# EAGLE schematic nocLock (EAGLE 7.1.0)
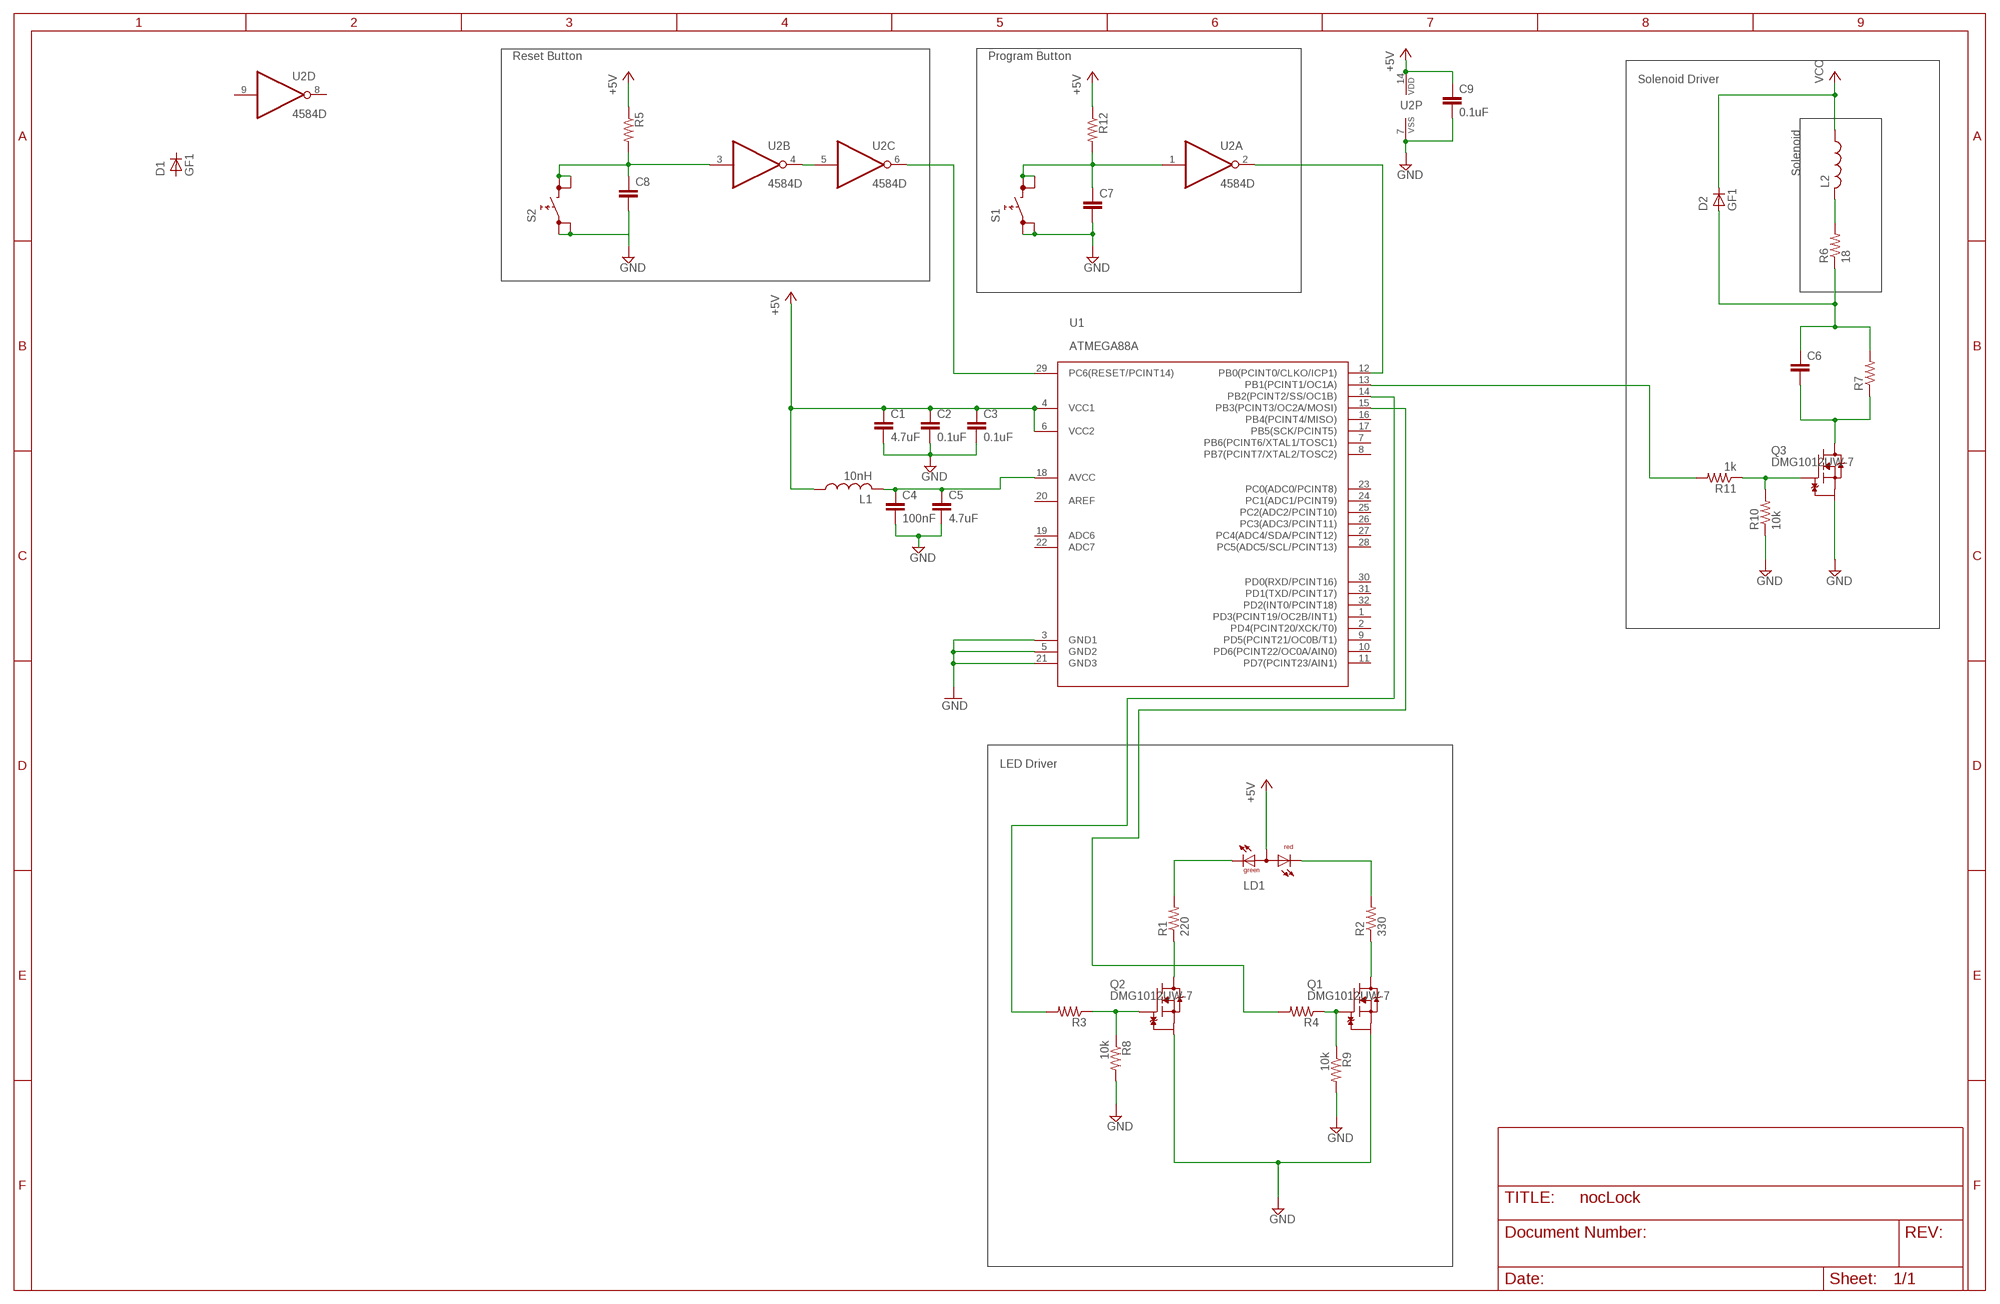
[diagram p0: schematic, sheet 1]

## Parts
C1  4.7uF  C-EUC0805  [C0805]
C2  0.1uF  C-EUC0805  [C0805]
C3  0.1uF  C-EUC0805  [C0805]
C4  100nF  C-EUC0805  [C0805]
C5  4.7uF  C-EUC0805  [C0805]
C6  C-EUC0805  [C0805]
C7  C-EUC0805  [C0805]
C8  C-EUC0805  [C0805]
C9  0.1uF  C-EUC0805  [C0805]
D1  GF1  [SMA-DO214AC]
D2  GF1  [SMA-DO214AC]
L1  10nH  L-USL4532C  [L4532M]
L2  L-USL4532C  [L4532M]
LD1  DUOLED-RG-A  [DUOLED-A-5MM]
Q1  DMG1012UW-7  [SOT323]
Q2  DMG1012UW-7  [SOT323]
Q3  DMG1012UW-7  [SOT323]
R1  220  R-US_R0805  [R0805]
R2  330  R-US_R0805  [R0805]
R3  R-US_R0805  [R0805]
R4  R-US_R0805  [R0805]
R5  R-US_R0805  [R0805]
R6  18  R-US_R0805  [R0805]
R7  R-US_R0805  [R0805]
R8  10k  R-US_R0805  [R0805]
R9  10k  R-US_R0805  [R0805]
R10  10k  R-US_R0805  [R0805]
R11  1k  R-US_R0805  [R0805]
R12  R-US_R0805  [R0805]
S1  SKHMPSE010  [SKHMPXE010]
S2  SKHMPSE010  [SKHMPXE010]
U1  ATMEGA88A  [TQFP32]
U2  4584D  [SO14]

## Nets
+5V: C1.1 C2.1 C3.1 C9.1 L1.1 LD1.A R5.1 R12.1 U1.4(VCC1) U1.6(VCC2) U2.14(P:VDD)
GND: C1.2 C2.2 C3.2 C4.2 C5.2 C7.2 C8.2 C9.2 Q1.3(S) Q2.3(S) Q3.3(S) R8.2 R9.2 R10.1 S1.1(1.1) S1.2(1.2) U1.3(GND1) U1.5(GND2) U1.21(GND3) U2.7(P:VSS)
GND1: S2.1(1.1) S2.2(1.2)
N$1: Q1.2(G) R4.1 R9.1
N$2: LD1.CX(CG) R1.2
N$3: LD1.CR R2.2
N$4: Q1.1(D) R2.1
N$5: Q2.1(D) R1.1
N$6: Q2.2(G) R3.1 R8.1
N$7: C4.1 C5.1 L1.2 U1.18(AVCC)
N$8: L2.2 R6.2
N$9: Q3.2(G) R10.2 R11.1
N$10: C6.1 D2.A R6.1 R7.2
N$11: C6.2 Q3.1(D) R7.1
N$12: U2.4(B:O) U2.5(C:I)
N$13: U1.12(PB0(PCINT0/CLKO/ICP1)) U2.2(A:O)
N$14: R11.2 U1.13(PB1(PCINT1/OC1A))
N$15: C8.1 R5.2 U2.3(B:I)
N$16: S2.3(2.1) S2.4(2.2)
N$17: R3.2 U1.14(PB2(PCINT2/SS/OC1B))
N$18: R4.2 U1.15(PB3(PCINT3/OC2A/MOSI))
N$19: C7.1 R12.2 S1.3(2.1) S1.4(2.2) U2.1(A:I)
N$20: U1.29(PC6(RESET/PCINT14)) U2.6(C:O)
VCC: D2.K(C) L2.1
Unconnected: D1.A D1.K(C) U1.1(PD3(PCINT19/OC2B/INT1)) U1.2(PD4(PCINT20/XCK/T0)) U1.7(PB6(PCINT6/XTAL1/TOSC1)) U1.8(PB7(PCINT7/XTAL2/TOSC2)) U1.9(PD5(PCINT21/OC0B/T1)) U1.10(PD6(PCINT22/OC0A/AIN0)) U1.11(PD7(PCINT23/AIN1)) U1.16(PB4(PCINT4/MISO)) U1.17(PB5(SCK/PCINT5)) U1.19(ADC6) U1.22(ADC7) U1.23(PC0(ADC0/PCINT8)) U1.24(PC1(ADC1/PCINT9)) U1.25(PC2(ADC2/PCINT10)) U1.26(PC3(ADC3/PCINT11)) U1.27(PC4(ADC4/SDA/PCINT12)) U1.28(PC5(ADC5/SCL/PCINT13)) U1.30(PD0(RXD/PCINT16)) U1.31(PD1(TXD/PCINT17)) U1.32(PD2(INT0/PCINT18)) U2.8(D:O) U2.9(D:I) U2.10(E:O) U2.11(E:I) U2.12(F:O) U2.13(F:I)

## Notes on the sheet
- Reset Button | Program Button
- Solenoid Driver
- Solenoid
- LED Driver

## Power pins joined to a net without a drawn wire
AREF: U1.20(AREF)

## Library data of the parts
C1-C9 = rcl:C-EU: CAPACITOR, European symbol
D1 D2 = diode:GF1: DIODE
L1 L2 = rcl:L-US: INDUCTOR, American symbol
LD1 = led:DUOLED-RG-A: DUO LED 2 colors (red/green), 5 mm, round, common Anode www.ligitek.com or other producers.
Q1-Q3 = nocLock_temp:DMG1012UW-7
R1-R12 = rcl:R-US_: RESISTOR, American symbol
S1 S2 = switch:SKHMP*E010: 6.2 X 6.5mm TACT Switch (SMD) Source: http://www3.alps.co.jp/WebObjects/catalog.woa/PDF/E/Switch/Tact/SKHM/SKHM.PDF
U1 = nocLock_temp:ATMEGA88A: ATMega88A 8-Bit Microcontroller 23 GPIO pins RISC Architecture Up to 20 MHz
U2 = 45xx:4584: Hex SCHMITT TRIGGER (74C14)